# Altium schematic sheet INDEX.SchDoc
size 420 x 297 mm; SheetNumber: 1; SheetTotal: 6
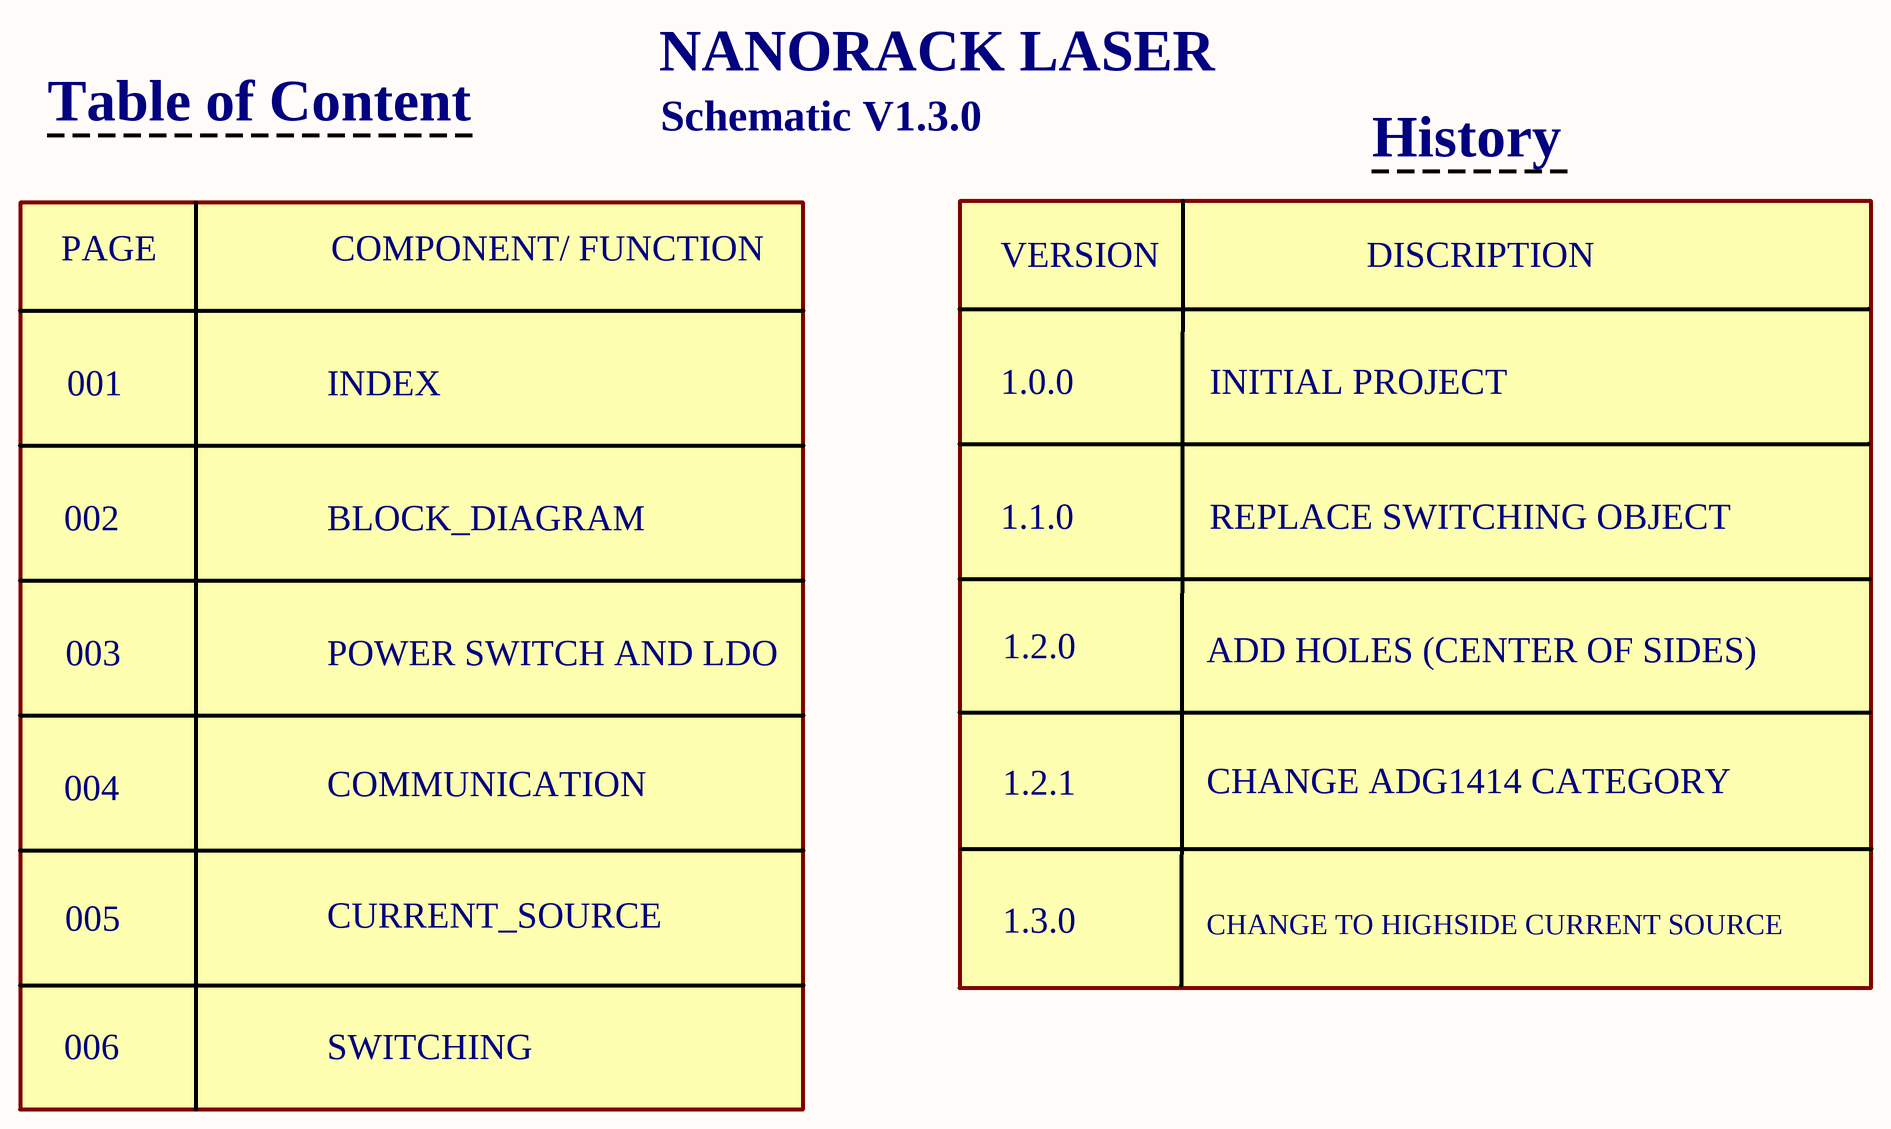
[diagram p0: INDEX.SchDoc]

## Notes on the sheet
- NANORACK LASER
- Table of Content
- Schematic V1.3.0
- History
- PAGE
- COMPONENT/ FUNCTION
- VERSION
- DISCRIPTION
- 001
- INDEX
- 1.0.0
- INITIAL PROJECT
- 002
- BLOCK_DIAGRAM
- 1.1.0
- REPLACE SWITCHING OBJECT
- 003
- POWER SWITCH AND LDO
- 1.2.0
- ADD HOLES (CENTER OF SIDES)
- 004
- COMMUNICATION
- 1.2.1
- CHANGE ADG1414 CATEGORY
- 005
- CURRENT_SOURCE
- 1.3.0
- CHANGE TO HIGHSIDE CURRENT SOURCE
- 006
- SWITCHING
- Project:
- BEE-PC1
- Sub-system:
- Design by:
- Hung Nguyen D.
- Bao Bui Q.
- Sheet title:
- Sheet
- A3
- of
- Checked by:
- Approved by:
- Vu Pham
- Revision:
- Document No:
- V1.3.0
- Size:
- Date: